# EAGLE design RgbLed (EAGLE 7.2.0)
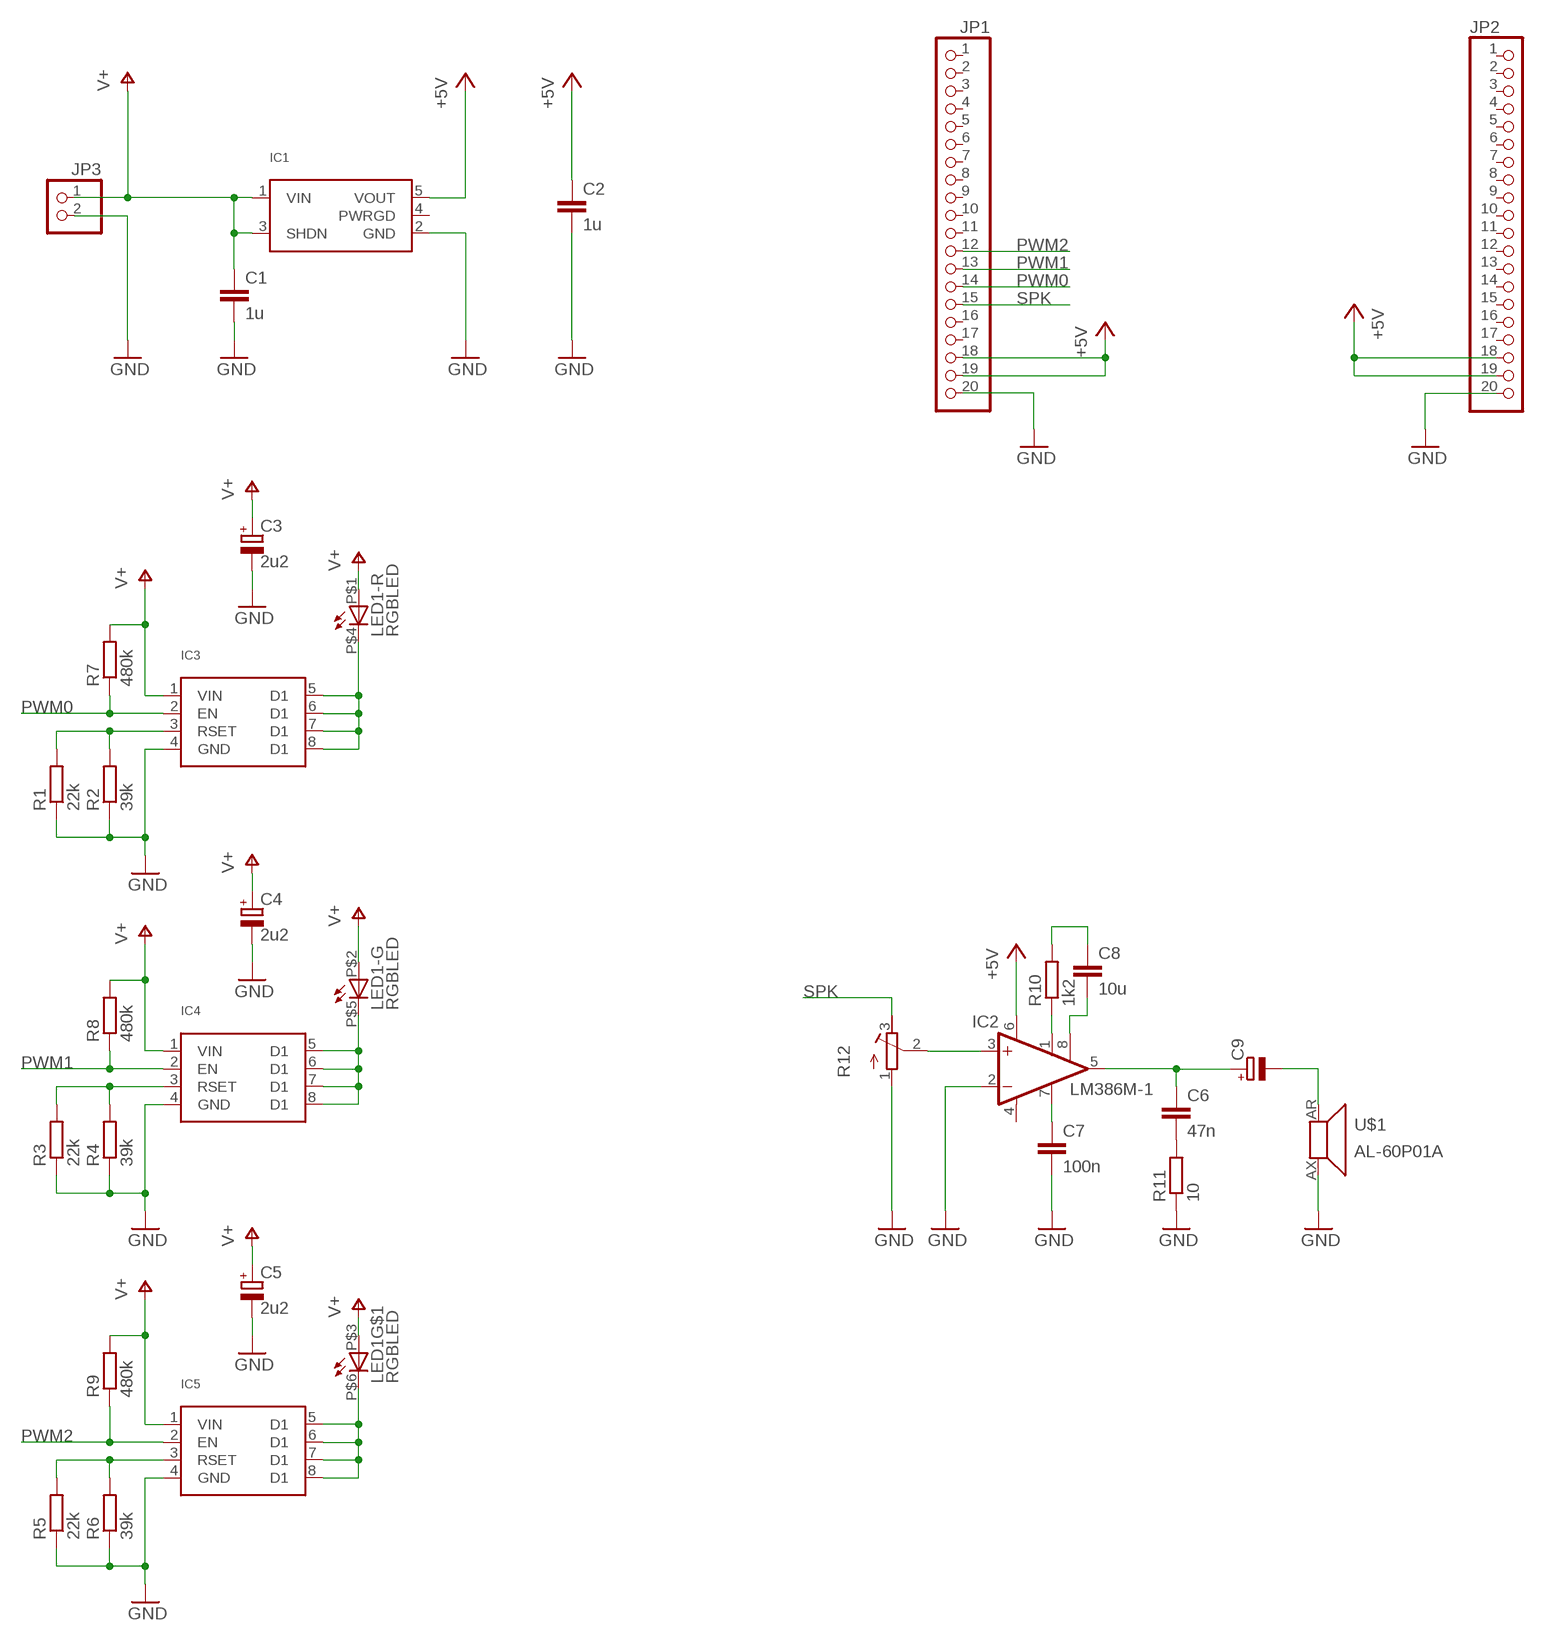
[diagram p0: schematic, sheet 1]

## Parts
C1  1u  C-EUC0805  [C0805]
C2  1u  C-EUC0805  [C0805]
C3  2u2  CPOL-EUB  [PANASONIC_B]
C4  2u2  CPOL-EUB  [PANASONIC_B]
C5  2u2  CPOL-EUB  [PANASONIC_B]
C6  47n  C-EUC0805  [C0805]
C7  100n  C-EUC0805  [C0805]
C8  10u  C-EUC0805  [C0805]
C9  CPOL-EUE  [PANASONIC_E]
IC1  MCP1755TSOT  [SOT23-5L]
IC2  LM386M-1  [SO08]
IC3  MIC4802YME  [SO8-COOL]
IC4  MIC4802YME  [SO8-COOL]
IC5  MIC4802YME  [SO8-COOL]
JP1  PINHD-1X20  [1X20]
JP2  PINHD-1X20  [1X20]
JP3  PINHD-1X2  [1X02]
LED1  RGBLED  [RGBLED]
R1  22k  R-EU_R0805  [R0805]
R2  39k  R-EU_R0805  [R0805]
R3  22k  R-EU_R0805  [R0805]
R4  39k  R-EU_R0805  [R0805]
R5  22k  R-EU_R0805  [R0805]
R6  39k  R-EU_R0805  [R0805]
R7  480k  R-EU_R0805  [R0805]
R8  480k  R-EU_R0805  [R0805]
R9  480k  R-EU_R0805  [R0805]
R10  1k2  R-EU_R0805  [R0805]
R11  10  R-EU_R0805  [R0805]
R12  R-TRIMM  [ACP6SMD]
U$1  AL-60P01A  [AL-60P01A]

## Nets
+5V: C2.1 IC1.5(VOUT) IC2.6(VS) JP1.18 JP1.19 JP2.18 JP2.19
GND: C1.2 C2.2 C3.- C4.- C5.- C7.2 IC1.2(GND) IC2.2(-IN) IC3.4(GND) IC4.4(GND) IC5.4(GND) JP1.20 JP2.20 JP3.2 R1.1 R2.1 R3.1 R4.1 R5.1 R6.1 R11.1 R12.1(A) U$1.AX
N$1: IC3.3(RSET) R1.2 R2.2
N$2: IC4.3(RSET) R3.2 R4.2
N$3: IC5.3(RSET) R5.2 R6.2
N$4: IC3.5(D1) IC3.6(D1) IC3.7(D1) IC3.8(D1) LED1.P$4(-R:C)
N$5: IC4.5(D1) IC4.6(D1) IC4.7(D1) IC4.8(D1) LED1.P$5(-G:C)
N$6: IC5.5(D1) IC5.6(D1) IC5.7(D1) IC5.8(D1) LED1.P$6(C)
N$7: IC2.1(GAIN) R10.1
N$8: C8.2 IC2.8(GAIN)
N$9: C8.1 R10.2
N$10: C7.1 IC2.7(BYPASS)
N$11: C6.2 R11.2
N$12: C6.1 C9.+ IC2.5(OUT)
N$13: C9.- U$1.AR
N$14: IC2.3(+IN) R12.2(S)
PWM0: IC3.2(EN) JP1.14 R7.1
PWM1: IC4.2(EN) JP1.13 R8.1
PWM2: IC5.2(EN) JP1.12 R9.1
SPK: JP1.15 R12.3(E)
V+: C1.1 C3.+ C4.+ C5.+ IC1.1(VIN) IC1.3(SHDN) IC3.1(VIN) IC4.1(VIN) IC5.1(VIN) JP3.1 LED1.P$1(-R:A) LED1.P$2(-G:A) LED1.P$3(A) R7.2 R8.2 R9.2
Unconnected: IC1.4(PWRGD) JP1.1 JP1.2 JP1.3 JP1.4 JP1.5 JP1.6 JP1.7 JP1.8 JP1.9 JP1.10 JP1.11 JP1.16 JP1.17 JP2.1 JP2.2 JP2.3 JP2.4 JP2.5 JP2.6 JP2.7 JP2.8 JP2.9 JP2.10 JP2.11 JP2.12 JP2.13 JP2.14 JP2.15 JP2.16 JP2.17

## Power pins joined to a net without a drawn wire
GND: IC2.4(GND)

## Library data of the parts
C1 C2 C6-C8 = resistor:C-EU: CAPACITOR, European symbol
C3-C5 C9 = resistor:CPOL-EU: POLARIZED CAPACITOR, European symbol
IC1 = steron:MCP1755TSOT: MCP 1755TSOT - LDO Regulator Elektrische Werte Eingangsspannung 3,6 ... 16 VDC Ausgangsstrom 300 m A Ausgangsspannung 5,0 VDC
IC2 = linear:LM386?-*: Low Voltage Audio Power Amplifier Source: http://cache.national.com/ds/LM/LM386.pdf
IC3-IC5 = steron:MIC4802YME: MIC4802YME - Linear WLED Driver Technical Specifications: High Efficiency (no Voltage Boost losses) Ultra Fast PWMTM control (200Hz to 500kHz) Input voltage range: 3.0V to 5.5V Dropout of 280mV at 800mA Programmable LED current with external resistor Current accuracy of ±1% typical
JP1 JP2 = pinhead:PINHD-1X20: PIN HEADER
JP3 = pinhead:PINHD-1X2: PIN HEADER
LED1 = steron:RGBLED: RGB LED Forward Voltage: red = 2.2 V. green / blue = 3.4V Forward Current: 350 mA (. To max 1000 mA) Reverse voltage: 5 V reverse current (VR = 5V): red / green / blue = 5 uA. Power dissipation: 3 W. Aperture: red = 35, green = 70, blue = 20 lm. Light color: red, green, blue. Color Temperature: red = 620 k, 520 k = green, blue = 460 k Angle:. 140 °. Operating temperature: -30 to 60 ° C Chip material: InGaN, dimension (LxWxH): 14.5 x 8 x 5.1 mm
R1-R11 = resistor:R-EU_: RESISTOR, European symbol
R12 = steron:R-TRIMM: Trimm resistor
U$1 = steron:AL-60P01A: Signalgeber ohne Ansteuerung Printausführung. Der AL-60P01A ist ein elektromagnetischer Signalgeber vielseitig einsetzbar.

## Board
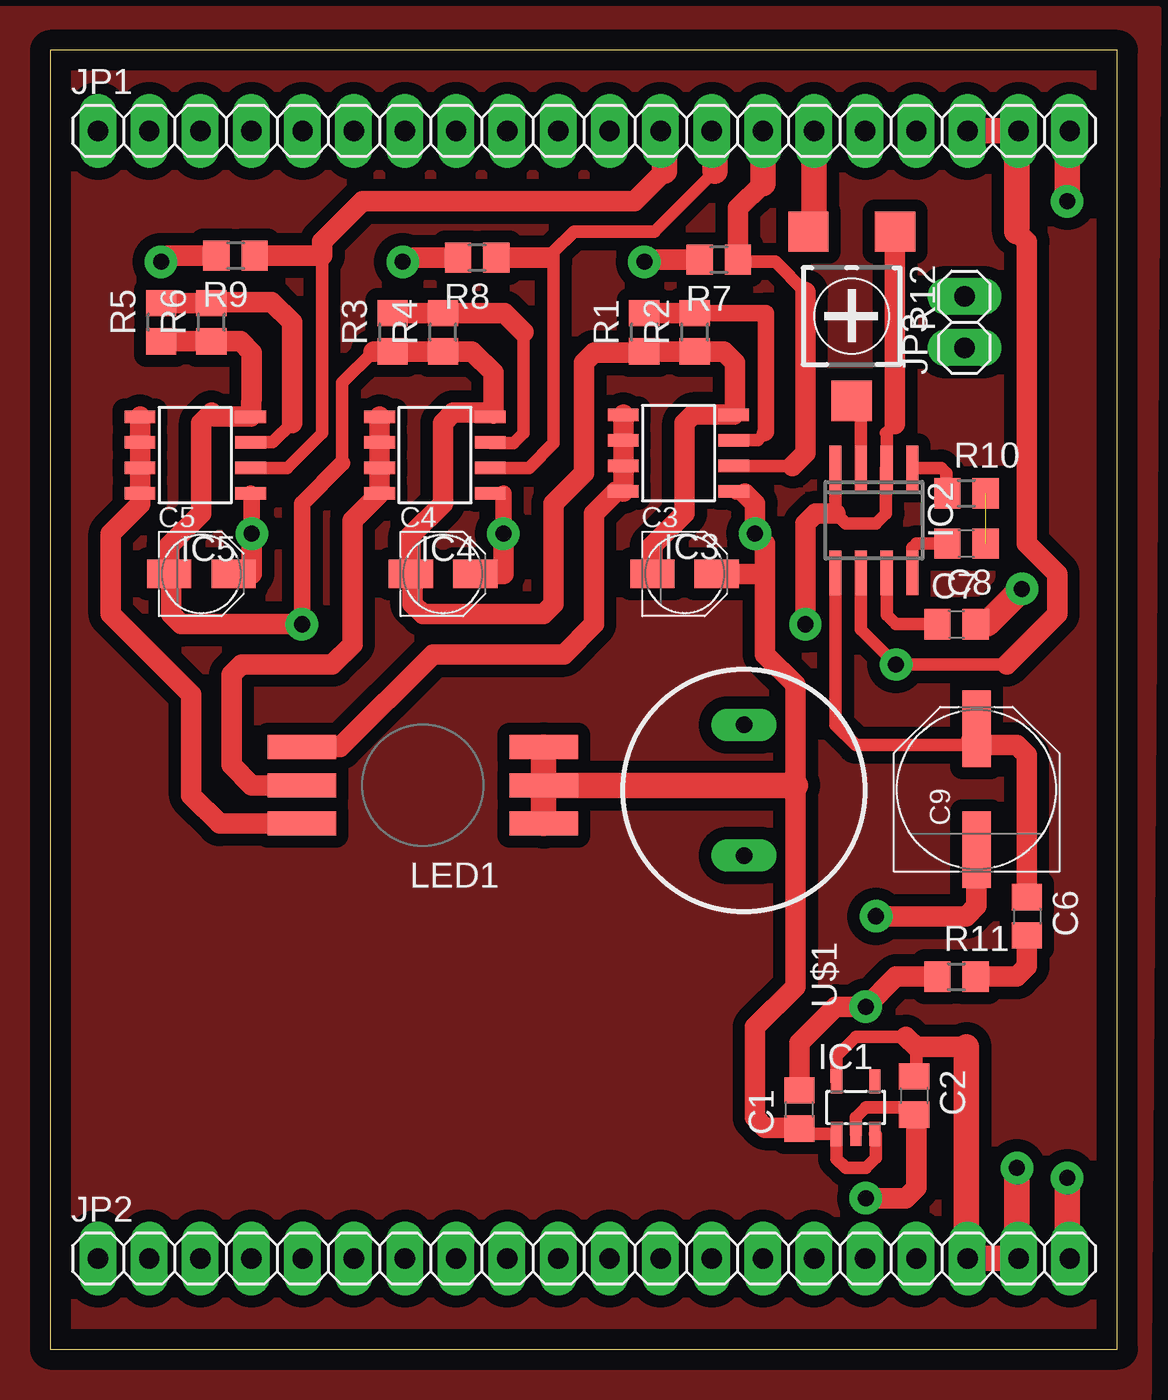
[diagram p1: board, top side]
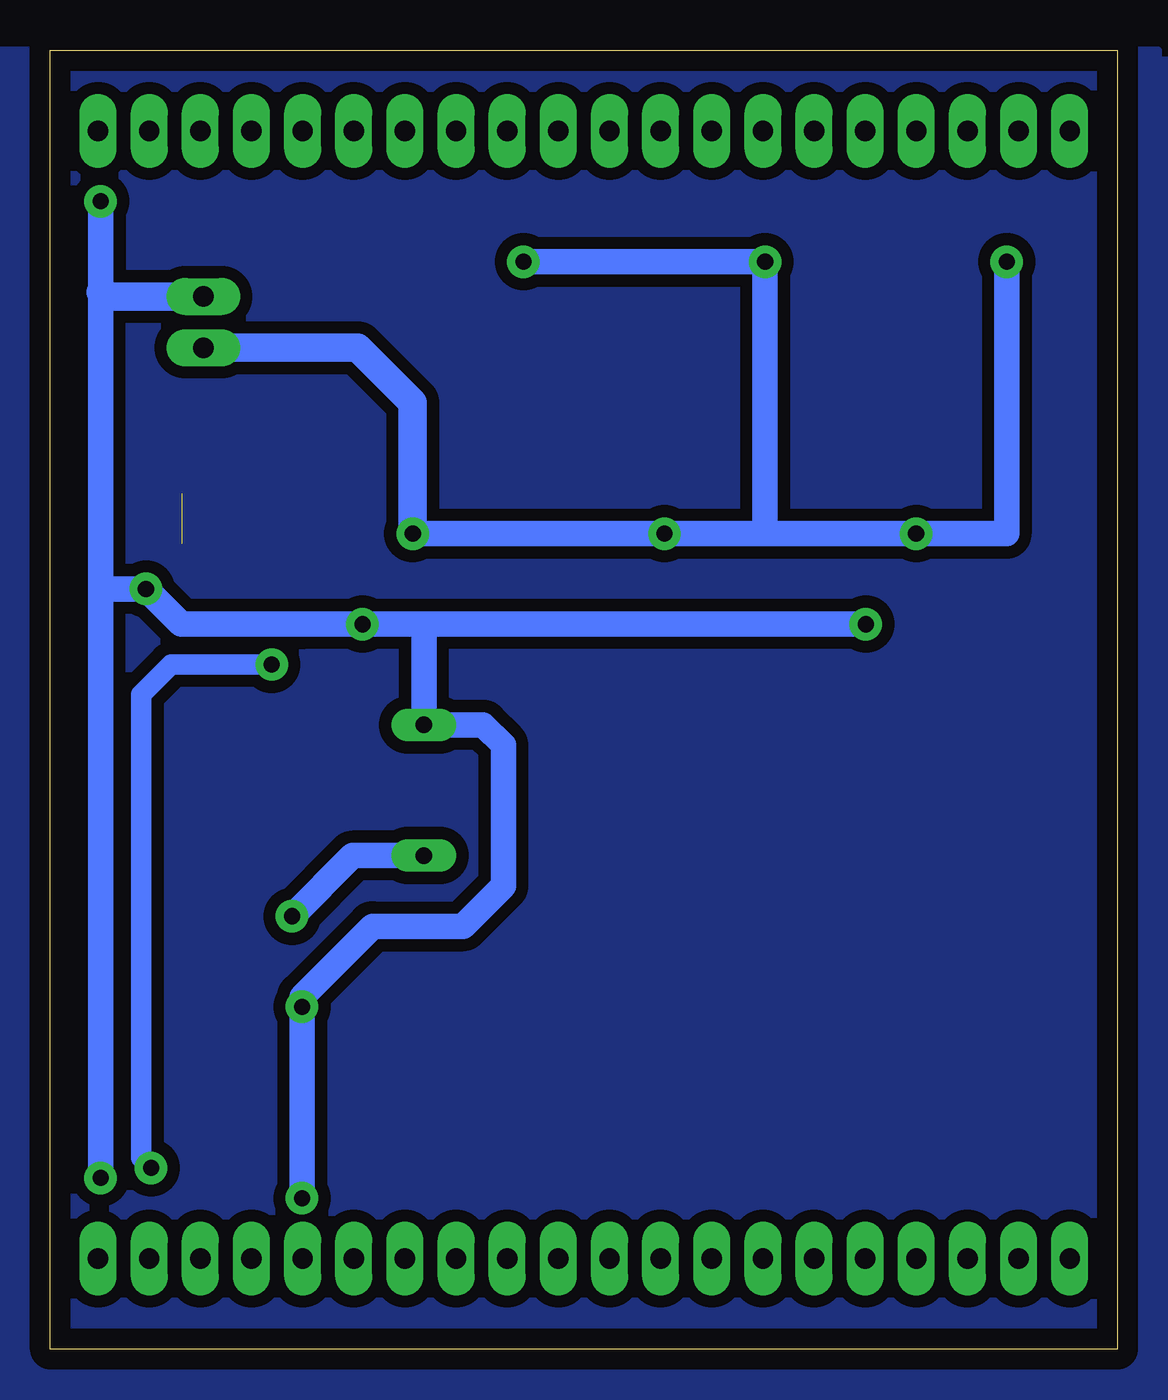
[diagram p2: board, bottom side, seen from below]

Size 53 x 64.5 mm. Coordinates in mm from the lower left corner, seen from the top.
Outline: 0,0 53,0 53,64.5 0,64.5 0,0
Copper layers (1*16): Top 0.035mm / dielectric 1.5mm / Bottom 0.035mm
Design rules "Aetzen": minimum track width 0.5mm, minimum drill 0.8mm, track to track 9mil, track to pad 9mil, pad to pad 9mil, via to via 9mil, smd to smd 9mil, copper to edge 40mil, drill to drill 8mil, minimum pad ring 16mil, minimum via ring 16mil, stop-mask expansion 4mil, vias tented up to drill 0mil, thermal gap 10mil

### Footprints (pad centres in the part's own frame; a part is rotated, then mirrored left to right if it is on the bottom)
C0805 = smd 1.3 x 1.5: 1 -0.95,0; 2 0.95,0
PANASONIC_B = smd 2.2 x 1.4: + 1.6,0; - -1.6,0
PANASONIC_E = smd 3.8 x 1.4: + 3,0; - -3,0
SOT23-5L = smd 0.55 x 1.2: 1 -0.95,-1.3; 2 0,-1.3; 3 0.95,-1.3; 4 0.95,1.3; 5 -0.95,1.3
SO08 = smd 0.6 x 2.2: 1 -1.905,-2.6; 2 -0.635,-2.6; 3 0.635,-2.6; 4 1.905,-2.6; 5 1.905,2.6; 6 0.635,2.6; 7 -0.635,2.6; 8 -1.905,2.6
SO8-COOL = smd 0.61 x 1.524: 1 -1.905,-2.743; 2 -0.635,-2.743; 3 0.635,-2.743; 4 1.905,-2.743; 5 1.905,2.743; 6 0.635,2.743; 7 -0.635,2.743; 8 -1.905,2.743
1X20 = drill 1.016 long: 1 -24.13,0; 2 -21.59,0; 3 -19.05,0; 4 -16.51,0; 5 -13.97,0; 6 -11.43,0; 7 -8.89,0; 8 -6.35,0; 9 -3.81,0; 10 -1.27,0; 11 1.27,0; 12 3.81,0; 13 6.35,0; 14 8.89,0; 15 11.43,0; 16 13.97,0; 17 16.51,0; 18 19.05,0; 19 21.59,0; 20 24.13,0
1X02 = drill 1.016 long: 1 -1.27,0; 2 1.27,0
RGBLED = smd 3.4 x 1.2: P$1 -6,1.9; P$2 -6,0; P$3 -6,-1.9; P$4 6,-1.9; P$5 6,0; P$6 6,1.9
R0805 = smd 1.3 x 1.5: 1 -0.95,0; 2 0.95,0
ACP6SMD = smd 2 x 2: 1 -2.15,-4.2; 2 0,4.2; 3 2.15,-4.2
AL-60P01A = drill 0.813 long: AR 3.24,0; AX -3.25,0

### Placement (x,y rotation side)
C1  37.2,11.9 90 top
C2  42.9,12.6 270 top
C3  31.5,38.5 0 top
C4  19.5,38.5 0 top
C5  7.5,38.5 0 top
C6  48.5,21.5 270 top
C7  45,36 0 top
C8  45.5,40 180 top
C9  46,27.8 90 top
IC1  40,12 0 top
IC2  40.9,41.16 180 top
IC3  31.2,44.5 90 top
IC4  19.1,44.4 90 top
IC5  7.2,44.4 90 top
JP1  26.5,60.5 0 top
JP2  26.5,4.5 0 top
JP3  45.4,51 90 top
LED1  18.5,28 180 top
R1  29.5,50.5 90 top
R2  32,50.5 90 top
R3  17,50.5 90 top
R4  19.5,50.5 90 top
R5  5.5,51 90 top
R6  8,51 90 top
R7  33.2,54.1 180 top
R8  21.2,54.2 180 top
R9  9.2,54.3 180 top
R10  45.5,42.5 0 top
R11  45,18.5 0 top
R12  39.8,51.3 180 top
U$1  34.45,27.75 270 top

### Tracks (layer width: path | path; a pad name or v marks a point on that pad's centre or on a via)
+5V  (via drill 0.8)
  Top 0.61: 42.5,15.5 40,15.5 39.05,14.55 IC1.5 | 43,15 43,13.65 | 43,13.65 C2.1 | 43,13.65 43,13.5 | IC2.6 40.27,35.73 v42,34 47.5,34 | 48,60.41 JP1.19 | 48,4.59 JP2.19
  Top 1.016: 42.5,15.5 43,15 45.5,15 | 47.5,34 50,36.5 50,38.5 48.5,40 48.5,55 48,55.5 | 45.5,4.55 JP2.18
  Top 1.27: 48,55.5 48,60.41 | JP1.18 JP1.19 | 45.5,15 45.5,4.55 | v48,9 48,4.59 | JP2.18 JP2.19
  Bottom 1.016: v42,34 47,34 48.5,32.5 48.5,9.5 v48,9
GND  (via drill 0.8)
  Top 0.61: 5.95,50 R5.1 | 16.05,49.55 14.5,48 14.5,44 | 6,38.4 C5.- | 22,46.46 IC4.4 21.65,46.5 | 18,38.4 C4.- | C2.2 42.55,12 40.5,12 40,11.5 IC1.2 | IC2.4 38.99,41.51 39.5,41 41,41 41.5,41.5 41.5,43.73 IC2.2 41.53,45.47 41.5,45.5 41.95,45.95 | C7.2 46.5,36
  Top 0.813: 14.5,44 12.5,42 v12.5,36
  Top 1.016: C5.- 5.9,39.9 7.5,41.5 7.5,46 8,46.5 8.2,46.3 IC5.4 10,47.36 10,49.5 9.45,50.05 R6.1 R5.1 | 16.05,49.55 R3.1 R4.1 20.95,49.55 22,48.5 22,46.46 | v12.5,36 6.5,36 6,36.5 6,38.4 | C4.- 17.9,40.4 19.5,42 19.5,46 20,46.5 21.65,46.5 | 18,38.4 18,37 18.5,36.5 24.5,36.5 25,37 25,42 26.5,43.5 26.5,49 27,49.5 29.95,49.5 R1.1 R2.1 33.45,49.55 34,49 34,46.46 IC3.4 31.91,46.41 31.5,46 31.5,41.5 29.9,39.9 C3.- | v40.5,7.5 42.5,7.5 43,8 43,11.55 C2.2 | 50.5,60.37 JP1.20 | R12.1 41.95,45.95 | v37.5,36 37.5,41 38,41.5 38.99,41.5 38.99,41.51 | C1.2 37.2,15.2 39,17 v40.5,17 42,18.5 R11.1 | 50.5,4.63 JP2.20
  Top 1.27: 46.5,36 v48.25,37.75 | v50.5,57 50.5,60.37 | v50.5,8.5 50.5,4.63
  Bottom 1.016: 40.45,35.95 40.5,36 | 34.45,35.95 34.5,36 | v40.5,17 40.5,17.5 | 35,31 U$1.AX
  Bottom 1.27: v12.5,36 34.5,36 v37.5,36 40.5,36 46.5,36 v48.25,37.75 50.25,37.75 50.5,38 | v40.5,17 v40.5,7.5 | 34.45,35.95 U$1.AX 31.5,31 30.5,30 30.5,23 32.5,21 37,21 40.5,17.5 | v50.5,57 50.5,52.5 50.5,38 | v50.5,8.5 50.5,38
  Bottom 1.422: JP3.2 50.27,52.27 50.5,52.5
N$1
  Top 0.61: IC3.3 35.13,45.13 35.5,45.5
  Top 0.813: 35.5,45.5 35.55,45.55 35.55,51.45 R2.2
  Top 1.016: R1.2 R2.2
N$2
  Top 0.61: 23.5,50.5 23.5,45.5 23,45 21.88,45 IC4.3
  Top 1.016: R3.2 R4.2 22.55,51.45 23.5,50.5
N$3
  Top 0.61: 8.05,52 R6.2 | IC5.3 11.04,45.03 12,46
  Top 1.016: 12,46 12,51 11,52 8.05,52 | R6.2 R5.2
N$4
  Top 0.61: IC3.8 28.09,42.59
  Top 1.016: IC3.5 IC3.6 IC3.7 IC3.8 | 28.09,42.59 27,41.5 27,36 25.5,34.5 19,34.5 14.4,29.9 LED1.P$4
N$5
  Top 1.016: IC4.5 IC4.6 IC4.7 IC4.8 15,41.14 15,35 14,34 9.5,34 9,33.5 9,29 10,28 LED1.P$5
N$6
  Top 1.016: IC5.5 IC5.6 IC5.7 IC5.8 4.46,41.96 3,40.5 3,36.5 7,32.5 7,27.5 8.4,26.1 LED1.P$6
N$7
  Top 0.61: IC2.1 44.24,43.76 44.5,43.5 44.5,42.05 R10.1
N$8
  Top 0.61: IC2.8 42.8,39.8 43,40 C8.2
N$9  (1 unrouted)
N$10
  Top 0.61: IC2.7 41.53,36.47 42,36 C7.1
N$11
  Top 1.016: R11.2 48,18.5 48.5,19 C6.2
N$12
  Top 0.61: IC2.5 38.99,31 40,30 45.5,30 45.75,30.25 46,30.5 C9.+ 46,31.5
  Top 1.016: C6.1 48.5,29.5 48,30 46,30 45.75,30.25
N$13  (via drill 0.8)
  Top 1.016: v41,21.5 45.5,21.5 46,22 C9.-
  Bottom 1.27: U$1.AR 37.99,24.51 v41,21.5
N$14
  Top 0.61: IC2.3 40.27,46.63 R12.2
N$15
  pour Top (isolate 0.61): -2.5,62.5 -3.5,-3.5 54.5,-4 55,66.5 -2.5,66.5
N$16
  pour Bottom (isolate 0.61): -2,64 -3.5,64 -3.5,-6.5 57,-6.5 56.5,64.5 -2,64.5
PWM0
  Top 0.61: IC3.2 36.87,43.87 | 37.5,52.5 36,54 34.25,54 R7.1
  Top 1.016: 36.87,43.87 37.5,44.5 37.5,52.5 | 35.39,57.89 34.15,56.65 R7.1
  Top 1.27: JP1.14 35.39,57.89
PWM1
  Top 0.61: IC4.2 23.77,43.77 25,45 25,54 | 25,54 25,54.5 26,55.5 30,55.5 33,58.5 | 24.8,54.2 25,54
  Top 1.016: 33,60.35 JP1.13 | R8.1 24.8,54.2
  Top 1.27: 33,58.5 33,60.35
PWM2
  Top 0.61: IC5.2 11.77,43.77 13.5,45.5 13.5,54.3
  Top 1.016: 30.5,58.5 29,57 15.5,57 13.5,55 13.5,54.3 R9.1 | 30.5,60.31 JP1.12
  Top 1.27: 30.5,58.5 30.5,60.31
SPK
  Top 1.016: 37.93,55.78 R12.3
  Top 1.27: JP1.15 37.93,55.78
V+  (via drill 0.8)
  Top 0.61: IC4.1 22.5,42.49 | 34.5,42.5 34.04,42.5 IC3.1 | 37.42,10.73 C1.1 37.45,10.7 IC1.1 39.05,9.45 39.5,9 40.5,9 41,9.5 41,10.65 IC1.3
  Top 0.813: v10,40.5 10,42.44 IC5.1 | v22.5,40.5 22.5,42.49
  Top 1.016: R9.2 5.8,54.3 v5.5,54 | R8.2 17.7,54.2 v17.5,54 | R7.2 29.6,54.1 v29.5,54 | v10,40.5 10,38.5 C5.+ | C4.+ 22.5,38.5 v22.5,40.5 | C3.+ 35.5,38.5 | 35.5,38.5 35.5,40 v35,40.5 35,42 34.5,42.5 | 35.5,38.5 35.5,34.5 37,33 37,28 37,18 35,16 35,11.5 35.5,11 37.15,11 C1.1
  Top 1.27: LED1.P$3 LED1.P$2 | LED1.P$2 LED1.P$1 | LED1.P$2 37,28
  Bottom 1.27: 17.5,40.5 v22.5,40.5 v35,40.5 | 17.5,40.5 v10,40.5 5.5,40.5 v5.5,54 | 17.5,40.5 v17.5,54 v29.5,54
  Bottom 1.422: JP3.1 37.73,49.73 35,47 v35,40.5